# Altium schematic sheet BV100011_ControlAI.SchDoc
size C
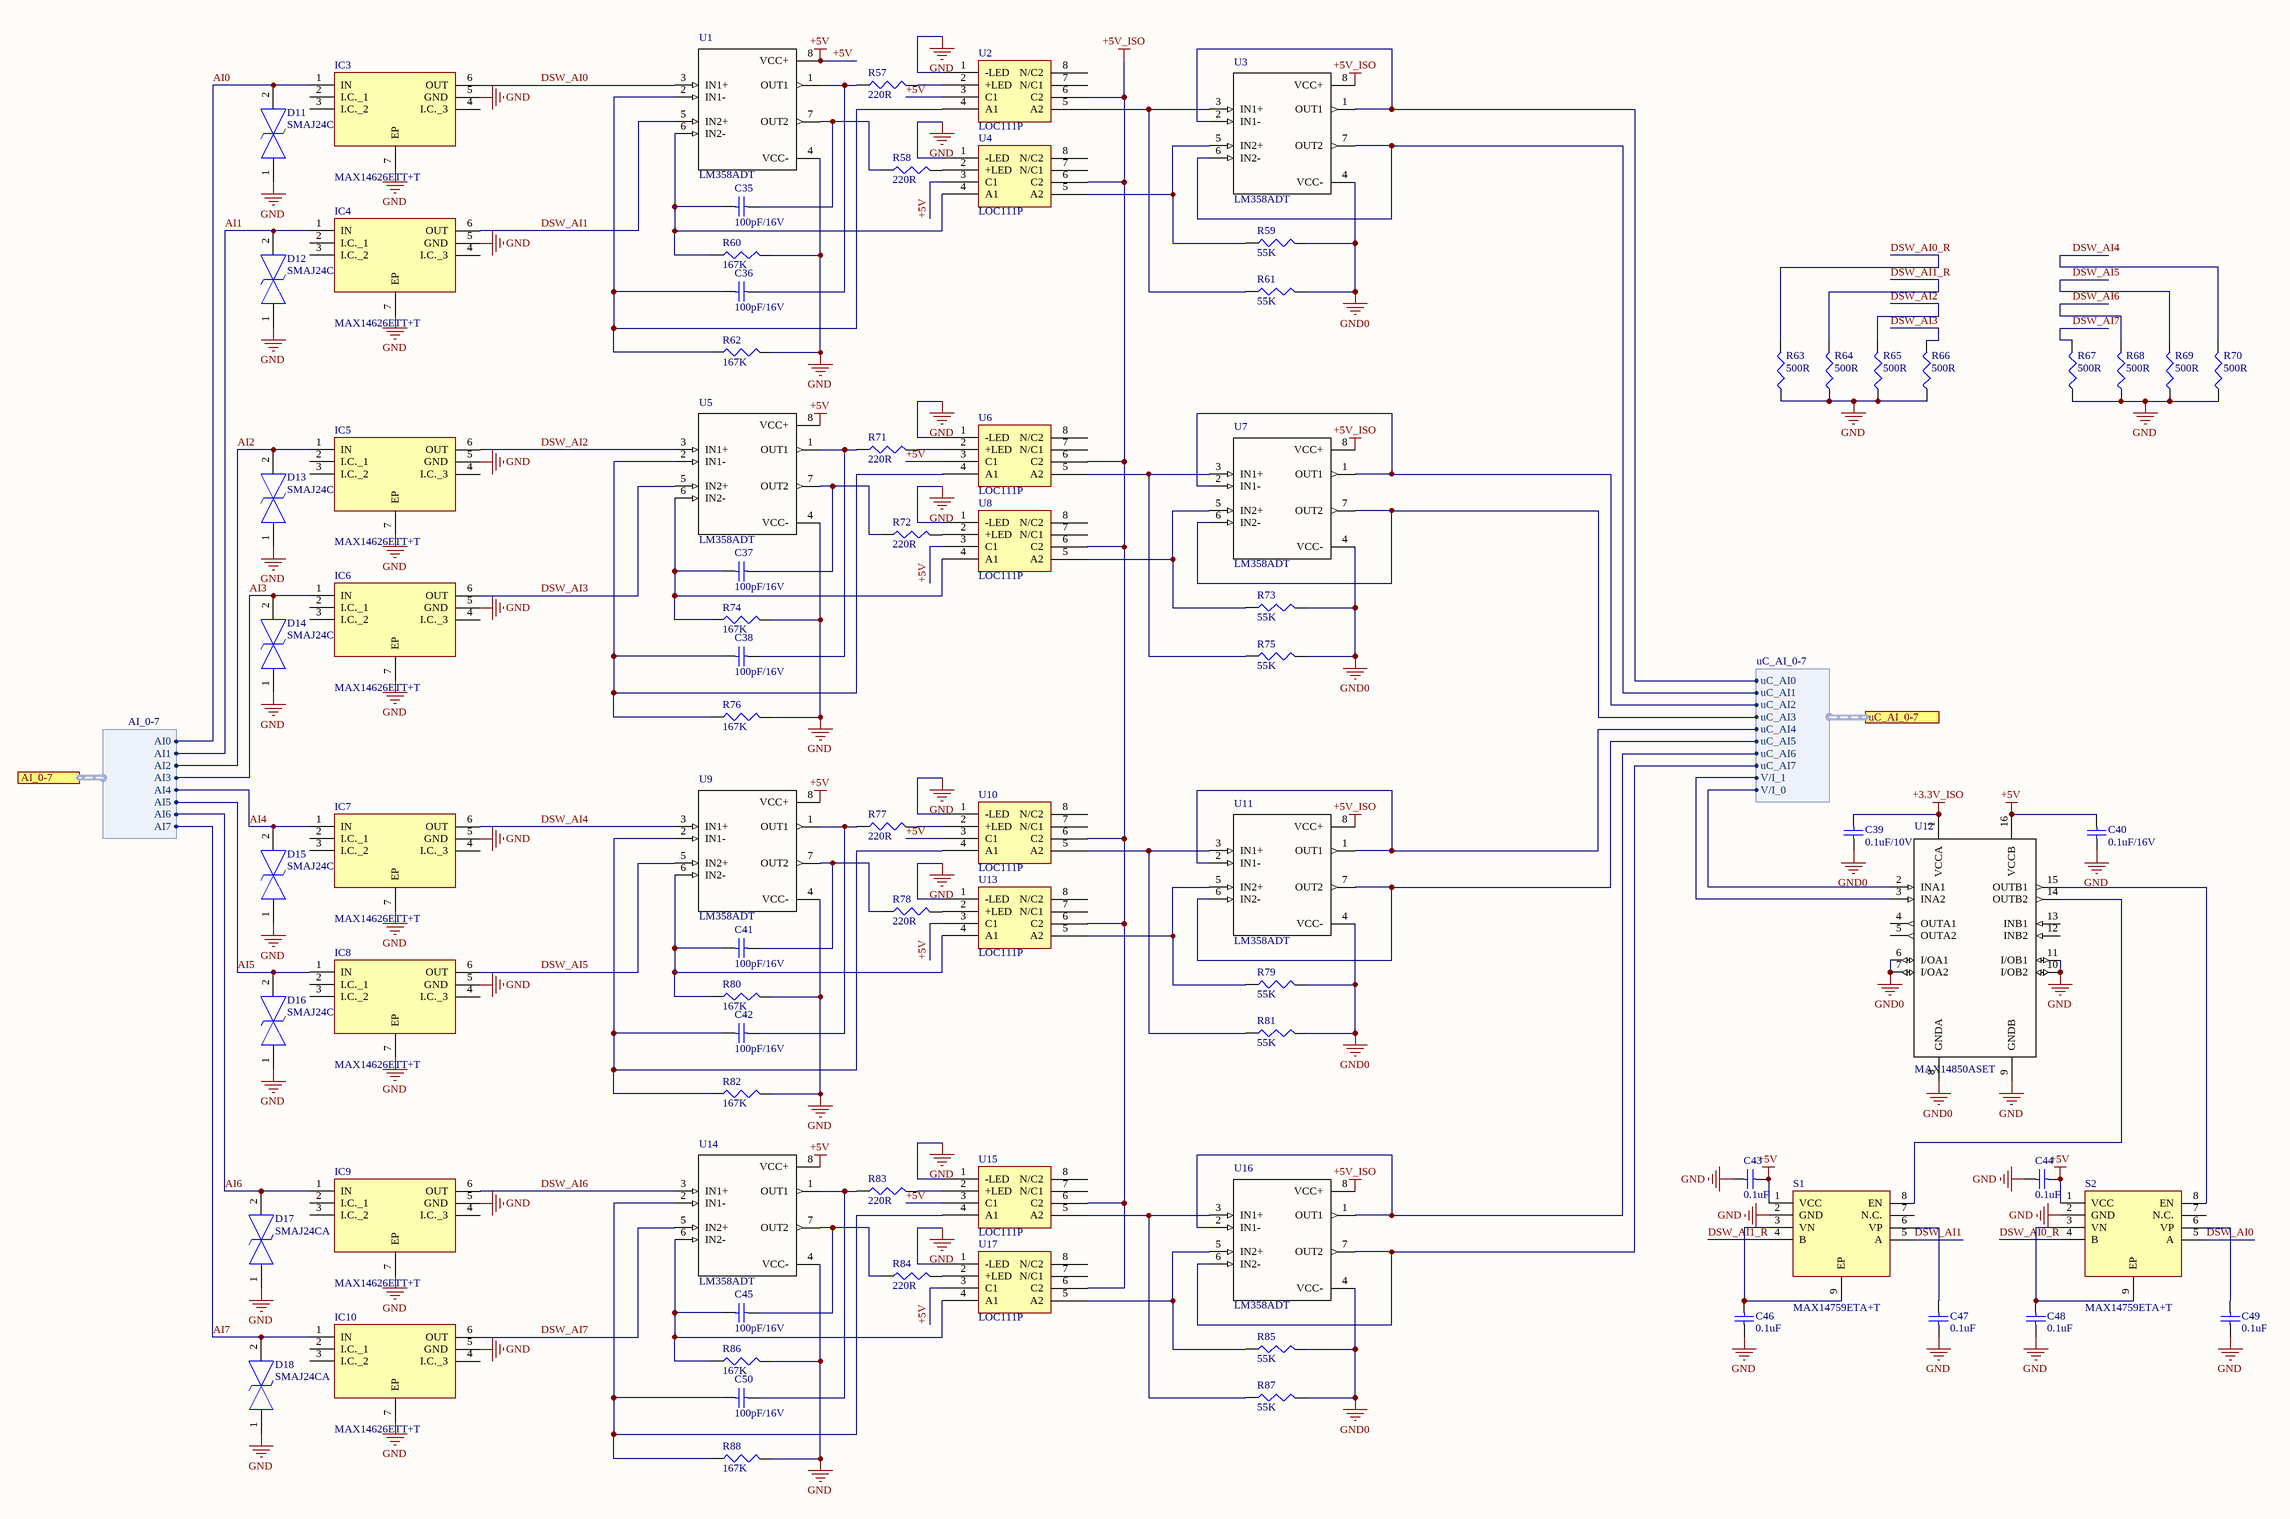
[diagram p0: BV100011_ControlAI.SchDoc]

## Parts
C35  100pF/16V  [C1206]
C36  100pF/16V  [C1206]
C37  100pF/16V  [C1206]
C38  100pF/16V  [C1206]
C39  0.1uF/10V  [C1206]
C40  0.1uF/16V  [C1206]
C41  100pF/16V  [C1206]
C42  100pF/16V  [C1206]
C43  0.1uF  [C1206]
C44  0.1uF  [C1206]
C45  100pF/16V  [C1206]
C46  0.1uF  [C1206]
C47  0.1uF  [C1206]
C48  0.1uF  [C1206]
C49  0.1uF  [C1206]
C50  100pF/16V  [C1206]
D11  SMAJ24CA  [DIONM5026X229N]
D12  SMAJ24CA  [DIONM5026X229N]
D13  SMAJ24CA  [DIONM5026X229N]
D14  SMAJ24CA  [DIONM5026X229N]
D15  SMAJ24CA  [DIONM5026X229N]
D16  SMAJ24CA  [DIONM5026X229N]
D17  SMAJ24CA  [DIONM5026X229N]
D18  SMAJ24CA  [DIONM5026X229N]
IC3  MAX14626ETT+T  [SON95P300X300X80-7N]
IC4  MAX14626ETT+T  [SON95P300X300X80-7N]
IC5  MAX14626ETT+T  [SON95P300X300X80-7N]
IC6  MAX14626ETT+T  [SON95P300X300X80-7N]
IC7  MAX14626ETT+T  [SON95P300X300X80-7N]
IC8  MAX14626ETT+T  [SON95P300X300X80-7N]
IC9  MAX14626ETT+T  [SON95P300X300X80-7N]
IC10  MAX14626ETT+T  [SON95P300X300X80-7N]
R57  220R  [J1-0603]
R58  220R  [J1-0603]
R59  55K  [J1-0603]
R60  167K  [J1-0603]
R61  55K  [J1-0603]
R62  167K  [J1-0603]
R63  500R  [14-1210]
R64  500R  [14-1210]
R65  500R  [14-1210]
R66  500R  [14-1210]
R67  500R  [14-1210]
R68  500R  [14-1210]
R69  500R  [14-1210]
R70  500R  [14-1210]
R71  220R  [J1-0603]
R72  220R  [J1-0603]
R73  55K  [J1-0603]
R74  167K  [J1-0603]
R75  55K  [J1-0603]
R76  167K  [J1-0603]
R77  220R  [J1-0603]
R78  220R  [J1-0603]
R79  55K  [J1-0603]
R80  167K  [J1-0603]
R81  55K  [J1-0603]
R82  167K  [J1-0603]
R83  220R  [J1-0603]
R84  220R  [J1-0603]
R85  55K  [J1-0603]
R86  167K  [J1-0603]
R87  55K  [J1-0603]
R88  167K  [J1-0603]
S1  MAX14759ETA+T  [SON65P300X300X80-9N]
S2  MAX14759ETA+T  [SON65P300X300X80-9N]
U1  LM358ADT  [*SOIC127P600X175-8N]
U2  LOC111P  [SOP254P940X265-8N]
U3  LM358ADT  [*SOIC127P600X175-8N]
U4  LOC111P  [SOP254P940X265-8N]
U5  LM358ADT  [*SOIC127P600X175-8N]
U6  LOC111P  [SOP254P940X265-8N]
U7  LM358ADT  [*SOIC127P600X175-8N]
U8  LOC111P  [SOP254P940X265-8N]
U9  LM358ADT  [*SOIC127P600X175-8N]
U10  LOC111P  [SOP254P940X265-8N]
U11  LM358ADT  [*SOIC127P600X175-8N]
U12  MAX14850ASET  [*SOIC127P600X175-16N]
U13  LOC111P  [SOP254P940X265-8N]
U14  LM358ADT  [*SOIC127P600X175-8N]
U15  LOC111P  [SOP254P940X265-8N]
U16  LM358ADT  [*SOIC127P600X175-8N]
U17  LOC111P  [SOP254P940X265-8N]

## Ports
AI_0-7 (harness AI_0-7), uC_AI_0-7 (harness uC_AI_0-7)

## Harnesses
uC_AI_0-7: uC_AI0, uC_AI1, uC_AI2, uC_AI3, uC_AI4, uC_AI5, uC_AI6, uC_AI7, V/I_0, V/I_1
AI_0-7: AI0, AI1, AI2, AI3, AI4, AI5, AI6, AI7

## Nets
+3.3V_ISO: C39.1 U12.1(VCCA)
+5V: C40.1 C43.2 C44.2 S1.1(VCC) S2.1(VCC) U1.8(VCC+) U2.3(C1) U4.3(C1) U5.8(VCC+) U6.3(C1) U8.3(C1) U9.8(VCC+) U10.3(C1) U12.16(VCCB) U13.3(C1) U14.8(VCC+) U15.3(C1) U17.3(C1)
+5V_ISO: U2.6(C2) U3.8(VCC+) U4.6(C2) U6.6(C2) U7.8(VCC+) U8.6(C2) U10.6(C2) U11.8(VCC+) U13.6(C2) U15.6(C2) U16.8(VCC+) U17.6(C2)
GND: C40.2 C43.1 C44.1 C46.2 C47.2 C48.2 C49.2 D11.1(K) D12.1(K) D13.1(K) D14.1(K) D15.1(K) D16.1(K) D17.1(K) D18.1(K) IC3.5(GND) IC3.7(EP) IC4.5(GND) IC4.7(EP) IC5.5(GND) IC5.7(EP) IC6.5(GND) IC6.7(EP) IC7.5(GND) IC7.7(EP) IC8.5(GND) IC8.7(EP) IC9.5(GND) IC9.7(EP) IC10.5(GND) IC10.7(EP) R60.2 R62.2 R63.1 R64.1 R65.1 R66.1 R67.1 R68.1 R69.1 R70.1 R74.2 R76.2 R80.2 R82.2 R86.2 R88.2 S1.2(GND) S2.2(GND) U1.4(VCC-) U2.1(-LED) U4.1(-LED) U5.4(VCC-) U6.1(-LED) U8.1(-LED) U9.4(VCC-) U10.1(-LED) U12.9(GNDB) U12.10(I/OB2) U12.11(I/OB1) U13.1(-LED) U14.4(VCC-) U15.1(-LED) U17.1(-LED)
GND0: C39.2 R59.2 R61.2 R73.2 R75.2 R79.2 R81.2 R85.2 R87.2 U3.4(VCC-) U7.4(VCC-) U11.4(VCC-) U12.6(I/OA1) U12.7(I/OA2) U12.8(GNDA) U16.4(VCC-)
AI0: D11.2(A) IC3.1(IN) ; port AI_0-7.AI0
AI1: D12.2(A) IC4.1(IN) ; port AI_0-7.AI1
AI2: D13.2(A) IC5.1(IN) ; port AI_0-7.AI2
AI3: D14.2(A) IC6.1(IN) ; port AI_0-7.AI3
AI4: D15.2(A) IC7.1(IN) ; port AI_0-7.AI4
AI5: D16.2(A) IC8.1(IN) ; port AI_0-7.AI5
AI6: D17.2(A) IC9.1(IN) ; port AI_0-7.AI6
AI7: D18.2(A) IC10.1(IN) ; port AI_0-7.AI7
DSW_AI0: IC3.6(OUT) S2.5(A) U1.3(IN1+)
DSW_AI0_R: R63.2 S2.4(B)
DSW_AI1: IC4.6(OUT) S1.5(A) U1.5(IN2+)
DSW_AI1_R: R64.2 S1.4(B)
DSW_AI2: IC5.6(OUT) R65.2 U5.3(IN1+)
DSW_AI3: IC6.6(OUT) R66.2 U5.5(IN2+)
DSW_AI4: IC7.6(OUT) R70.2 U9.3(IN1+)
DSW_AI5: IC8.6(OUT) R69.2 U9.5(IN2+)
DSW_AI6: IC9.6(OUT) R68.2 U14.3(IN1+)
DSW_AI7: IC10.6(OUT) R67.2 U14.5(IN2+)
NetC35_1: C35.1 R60.1 U1.6(IN2-) U4.4(A1)
NetC35_2: C35.2 R58.1 U1.7(OUT2)
NetC36_1: C36.1 R62.1 U1.2(IN1-) U2.4(A1)
NetC36_2: C36.2 R57.1 U1.1(OUT1)
NetC37_1: C37.1 R74.1 U5.6(IN2-) U8.4(A1)
NetC37_2: C37.2 R72.1 U5.7(OUT2)
NetC38_1: C38.1 R76.1 U5.2(IN1-) U6.4(A1)
NetC38_2: C38.2 R71.1 U5.1(OUT1)
NetC41_1: C41.1 R80.1 U9.6(IN2-) U13.4(A1)
NetC41_2: C41.2 R78.1 U9.7(OUT2)
NetC42_1: C42.1 R82.1 U9.2(IN1-) U10.4(A1)
NetC42_2: C42.2 R77.1 U9.1(OUT1)
NetC45_1: C45.1 R86.1 U14.6(IN2-) U17.4(A1)
NetC45_2: C45.2 R84.1 U14.7(OUT2)
NetC46_1: C46.1 S1.3(VN) S1.9(EP)
NetC47_1: C47.1 S1.6(VP)
NetC48_1: C48.1 S2.3(VN) S2.9(EP)
NetC49_1: C49.1 S2.6(VP)
NetC50_1: C50.1 R88.1 U14.2(IN1-) U15.4(A1)
NetC50_2: C50.2 R83.1 U14.1(OUT1)
NetR57_2: R57.2 U2.2(+LED)
NetR58_2: R58.2 U4.2(+LED)
NetR59_1: R59.1 U3.5(IN2+) U4.5(A2)
NetR61_1: R61.1 U2.5(A2) U3.3(IN1+)
NetR71_2: R71.2 U6.2(+LED)
NetR72_2: R72.2 U8.2(+LED)
NetR73_1: R73.1 U7.5(IN2+) U8.5(A2)
NetR75_1: R75.1 U6.5(A2) U7.3(IN1+)
NetR77_2: R77.2 U10.2(+LED)
NetR78_2: R78.2 U13.2(+LED)
NetR79_1: R79.1 U11.5(IN2+) U13.5(A2)
NetR81_1: R81.1 U10.5(A2) U11.3(IN1+)
NetR83_2: R83.2 U15.2(+LED)
NetR84_2: R84.2 U17.2(+LED)
NetR85_1: R85.1 U16.5(IN2+) U17.5(A2)
NetR87_1: R87.1 U15.5(A2) U16.3(IN1+)
NetS1_8: S1.8(EN) U12.14(OUTB2)
NetS2_8: S2.8(EN) U12.15(OUTB1)
NetU3_1: U3.1(OUT1) U3.2(IN1-) ; port uC_AI_0-7.uC_AI0
NetU3_6: U3.6(IN2-) U3.7(OUT2) ; port uC_AI_0-7.uC_AI1
NetU7_1: U7.1(OUT1) U7.2(IN1-) ; port uC_AI_0-7.uC_AI2
NetU7_6: U7.6(IN2-) U7.7(OUT2) ; port uC_AI_0-7.uC_AI3
NetU11_1: U11.1(OUT1) U11.2(IN1-) ; port uC_AI_0-7.uC_AI4
NetU11_6: U11.6(IN2-) U11.7(OUT2) ; port uC_AI_0-7.uC_AI5
NetU12_2: U12.2(INA1) ; port uC_AI_0-7.V/I_0
NetU12_3: U12.3(INA2) ; port uC_AI_0-7.V/I_1
NetU16_1: U16.1(OUT1) U16.2(IN1-) ; port uC_AI_0-7.uC_AI6
NetU16_6: U16.6(IN2-) U16.7(OUT2) ; port uC_AI_0-7.uC_AI7

Not connected (* = marked no-connect by the designer): IC3 2(I.C._1) 3(I.C._2) 4(I.C._3); IC4 2(I.C._1) 3(I.C._2) 4(I.C._3); IC5 2(I.C._1) 3(I.C._2) 4(I.C._3); IC6 2(I.C._1) 3(I.C._2) 4(I.C._3); IC7 2(I.C._1) 3(I.C._2) 4(I.C._3); IC8 2(I.C._1) 3(I.C._2) 4(I.C._3); IC9 2(I.C._1) 3(I.C._2) 4(I.C._3); IC10 2(I.C._1) 3(I.C._2) 4(I.C._3); S1 7(N.C.); S2 7(N.C.); U2 7(N/C1) 8(N/C2); U4 7(N/C1) 8(N/C2); U6 7(N/C1) 8(N/C2); U8 7(N/C1) 8(N/C2); U10 7(N/C1) 8(N/C2); U12 4(OUTA1) 5(OUTA2) 12(INB2) 13(INB1); U13 7(N/C1) 8(N/C2); U15 7(N/C1) 8(N/C2); U17 7(N/C1) 8(N/C2)

## Library data of the parts
C35-C42 C45 C50 = Cap Semi: Capacitor (Semiconductor SIM Model); Published: 8-Jun-2000; LatestRevisionDate: 29-May-2009; LatestRevisionNote: IPC-7351 Footprint Added.; PackageReference: C1206; Publisher: Altium Limited; PackageDescription: Chip Capacitor
  C35-C38 C41 C42 C45 C50: Value: 100pF/16V
  C39: Value: 0.1uF/10V
  C40: Value: 0.1uF/16V
C43 C44 C46-C49 = Cap Semi: Capacitor (Semiconductor SIM Model); Value: 100pF/16V; Published: 8-Jun-2000; LatestRevisionDate: 29-May-2009; LatestRevisionNote: IPC-7351 Footprint Added.; PackageReference: C1206; Publisher: Altium Limited; PackageDescription: Chip Capacitor
D11-D18 = SMAJ24CA: TVS Diode (Bi-directional); Manufacturer_Name: LITTELFUSE; Datasheet Link: http://www.littelfuse.com/~/media/electronics/datasheets/tvs_diodes/littelfuse_tvs_diode_smaj_datasheet.pdf.pdf; Height: 2.29mm; Manufacturer_Part_Number: SMAJ24CA; Mouser Part Number: 576-SMAJ24CA; Mouser Price/Stock: https://www.mouser.com/Search/Refine.aspx?Keyword=576-SMAJ24CA; RS Part Number: 1719613P; RS Price/Stock: http://uk.rs-online.com/web/p/products/1719613P
IC3-IC10 = MAX14626ETT+T: Integrated Circuit; Manufacturer_Name: Maxim Integrated; Datasheet Link: http://datasheets.maximintegrated.com/en/ds/MAX14626.pdf; Height: 0.8mm; Manufacturer_Part_Number: MAX14626ETT+T; Mouser Part Number: 700-MAX14626ETT+T; Mouser Price/Stock: https://www.mouser.co.uk/ProductDetail/Maxim-Integrated/MAX14626ETT%2bT?qs=Vwh6e7toGLjhMUByPdHdJg%3D%3D
R57-R88 = Res3: Resistor; Published: 8-Jun-2000; LatestRevisionDate: 29-May-2009; LatestRevisionNote: IPC-7351 Footprint Added.; PackageReference: J1-0603; Publisher: Altium Limited; PackageDescription: Chip Resistor
  R57 R58 R71 R72 R77 R78 R83 R84: Value: 220R
  R59 R61 R73 R75 R79 R81 R85 R87: Value: 55K
  R60 R62 R74 R76 R80 R82 R86 R88: Value: 167K
  R63-R70: Value: 500R
S1 S2 = MAX14759ETA+T: Switch; Manufacturer_Name: Maxim Integrated; Datasheet Link: https://datasheets.maximintegrated.com/en/ds/MAX14759-MAX14763.pdf; Height: 0.8mm; Manufacturer_Part_Number: MAX14759ETA+T; Mouser Part Number: 700-MAX14759ETA+T; Mouser Price/Stock: https://www.mouser.co.uk/ProductDetail/Maxim-Integrated/MAX14759ETA%2bT?qs=2cAdsCoAWRFgTjPJwgxqqQ%3D%3D
U1 U3 U5 U7 U9 U11 U14 U16 = LM358ADT: LM358 Series 30 V 1.1 MHz Low Power Dual Operational Amplifier - SOIC-8; MF: STMicroelectronics; SnapEDA_Link: https://www.snapeda.com/parts/LM358ADT/STMicroelectronics/view-part/?ref=snap; MP: LM358ADT; Availability: Unavailable; Price: None; Package: SOIC-8 STMicroelectronics; Value: *
U2 U4 U6 U8 U10 U13 U15 U17 = LOC111P: Linear Optocoupler
U12 = MAX14850ASET: Digital Isolator, 6-Ch, 30ns, Nsoic-16; MF: Maxim Integrated; MP: MAX14850ASE+; SnapEDA_Link: https://www.snapeda.com/parts/MAX14850ASE%2B/Maxim%20Integrated/view-part/?ref=snap; Availability: Unavailable; Price: None; Package: SOIC-16 Maxim; Value: *